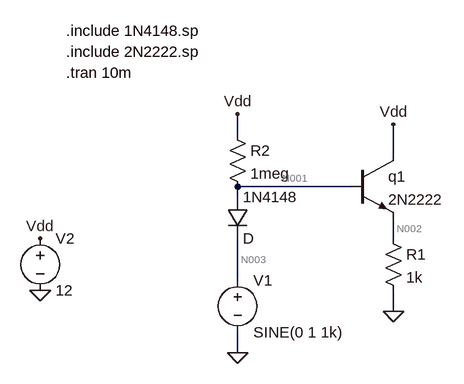
[diagram p0: schematic Draft1.asc]
Draft1.asc, the LTspice schematic file:
Version 4
SHEET 1 880 680
WIRE -304 48 -304 16
WIRE -64 80 -64 32
WIRE -128 128 -304 128
WIRE -304 144 -304 128
WIRE -64 208 -64 176
WIRE -304 272 -304 208
WIRE -64 320 -64 288
WIRE -304 384 -304 352
FLAG -64 320 0
FLAG -304 384 0
FLAG -608 288 0
FLAG -608 208 Vdd
FLAG -64 32 Vdd
FLAG -304 16 Vdd
SYMBOL npn -128 80 R0
SYMATTR InstName q1
SYMATTR Value 2N2222
SYMBOL res -80 192 R0
SYMATTR InstName R1
SYMATTR Value 1k
SYMBOL voltage -304 256 R0
WINDOW 123 0 0 Left 2
WINDOW 39 0 0 Left 2
SYMATTR InstName V1
SYMATTR Value SINE(0 1 1k)
SYMBOL voltage -608 192 R0
WINDOW 123 0 0 Left 2
WINDOW 39 0 0 Left 2
SYMATTR InstName V2
SYMATTR Value 12
SYMBOL diode -320 144 R0
SYMATTR InstName 1N4148
SYMBOL res -320 32 R0
SYMATTR InstName R2
SYMATTR Value 1meg
TEXT -568 -80 Left 2 !.include 2N2222.sp
TEXT -568 -48 Left 2 !.tran 10m
TEXT -568 -112 Left 2 !.include 1N4148.sp

The netlist it stands for:
* Draft1.asc
q1 Vdd N001 N002 0 2N2222
R1 N002 0 1k
V1 N003 0 SINE(0 1 1k)
V2 Vdd 0 12
D§1N4148 N001 N003 D
R2 Vdd N001 1meg
.model D D
.lib standard.dio
.model NPN NPN
.model PNP PNP
.lib standard.bjt
.include 2N2222.sp
.tran 10m
.include 1N4148.sp
.backanno
.end

* Results of the author's LTspice run, read from the files saved beside the schematic
* Operating Point, zero values left out:
*   V(vdd) = 12 V
*   V(n001) = 539.3 mV
*   V(n002) = 2.54 mV
*   Ic(Q1) = 2.443 µA
*   Ib(Q1) = 97.05 nA
*   Ie(Q1) = -2.54 µA
*   I(1n4148) = 11.36 µA
*   I(R2) = 11.46 µA
*   I(R1) = 2.54 µA
*   I(V2) = -13.9 µA
*   I(V1) = 11.36 µA
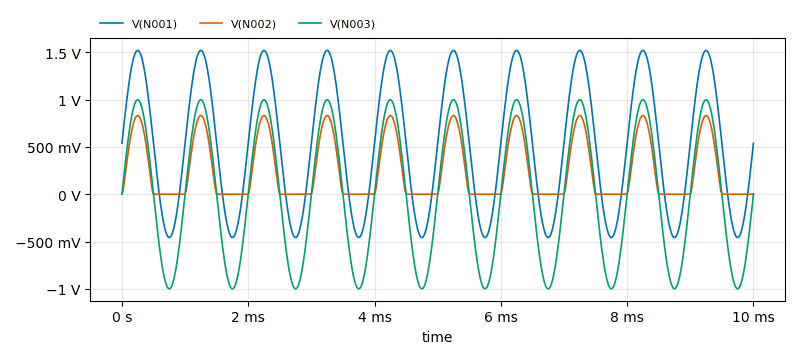
[diagram p1: Transient Analysis of Draft1.asc, plotted from the saved traces]
* Transient Analysis, 1 run:
*   V(N001): min -457.4 mV, max 1.52 V, average 534.5 mV, rms 880.2 mV, last 538.8 mV
*   V(N002): min -177.7 µV, max 831.6 mV, average 249.8 mV, rms 403 mV, last 2.68 mV
*   V(N003): min -999 mV, max 998.6 mV, average -273.7 µV, rms 706.3 mV, last 0 V